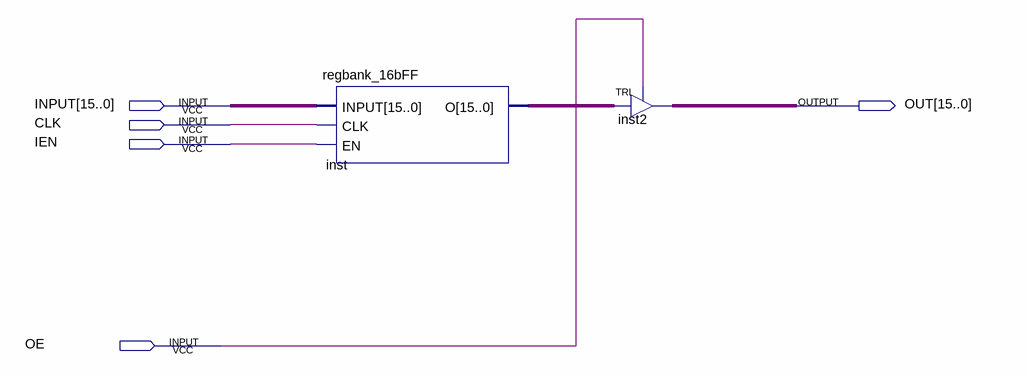
[diagram p0: schematic sheet]
// Quartus schematic regbank_16bMUX.bdf as structural Verilog: 2 symbols, 5 pins
module regbank_16bMUX (
  input  [15:0] INPUT,
  input  CLK,
  input  IEN,
  input  OE,
  output [15:0] OUT
);

  wire [15:0] inst_o;

  regbank_16bFF inst (.INPUT(INPUT), .CLK(CLK), .EN(IEN), .O(inst_o));
  TRI inst2[15:0] (.IN(inst_o), .OE(OE), .OUT(OUT));
endmodule
